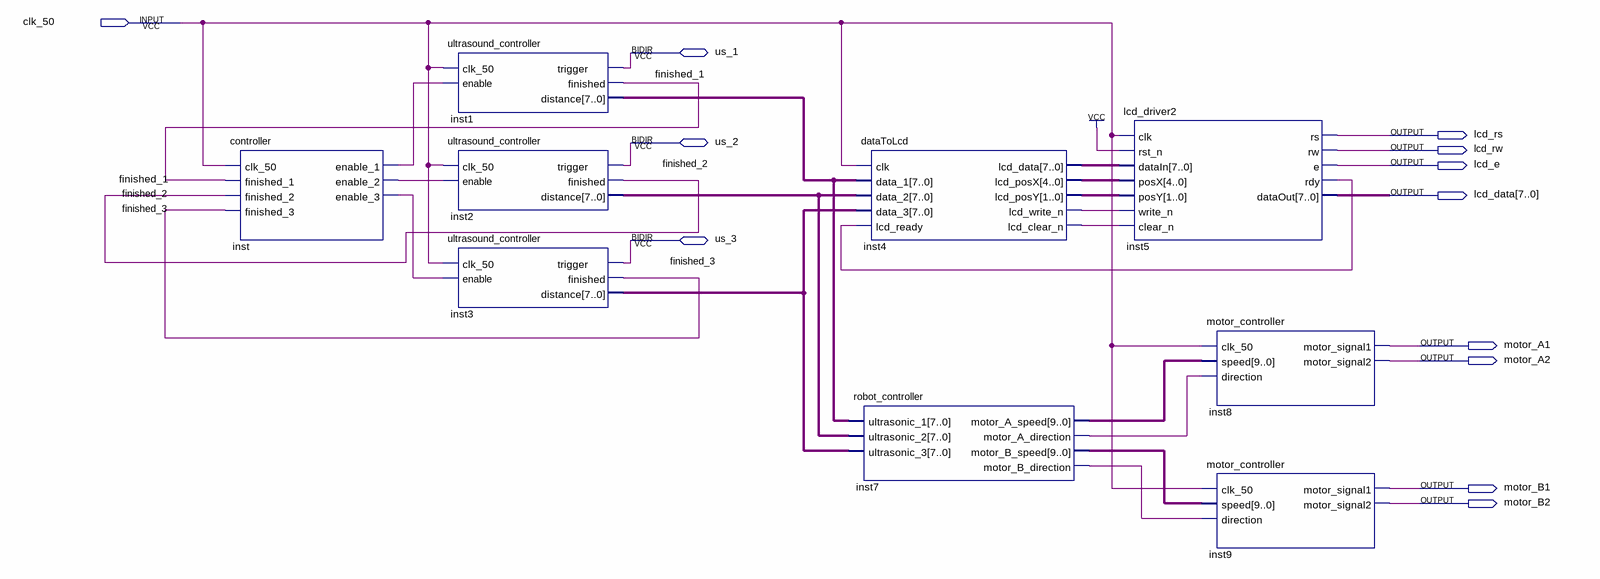
[diagram p0: schematic sheet]
// Quartus schematic ultrasound_reader.bdf as structural Verilog: 9 symbols, 12 pins
module ultrasound_reader (
  input  clk_50,
  inout  us_1,
  inout  us_2,
  inout  us_3,
  output lcd_rs,
  output lcd_rw,
  output lcd_e,
  output [7:0] lcd_data,
  output motor_A1,
  output motor_A2,
  output motor_B1,
  output motor_B2
);

  wire finished_1, finished_2, finished_3, inst4_lcd_clear_n, inst4_lcd_write_n, inst5_rdy,
       inst7_motor_a_direction, inst7_motor_b_direction, inst_enable_1, inst_enable_2, inst_enable_3;
  wire [1:0] inst4_lcd_posy;
  wire [4:0] inst4_lcd_posx;
  wire [7:0] inst1_distance, inst2_distance, inst3_distance, inst4_lcd_data;
  wire [9:0] inst7_motor_a_speed, inst7_motor_b_speed;

  controller inst (
    .clk_50(clk_50), .finished_1(finished_1), .finished_2(finished_2), .finished_3(finished_3),
    .enable_1(inst_enable_1), .enable_2(inst_enable_2), .enable_3(inst_enable_3));
  ultrasound_controller inst1 (
    .clk_50(clk_50), .enable(inst_enable_1), .finished(finished_1), .distance(inst1_distance), .trigger(us_1));
  ultrasound_controller inst2 (
    .clk_50(clk_50), .enable(inst_enable_2), .finished(finished_2), .distance(inst2_distance), .trigger(us_2));
  ultrasound_controller inst3 (
    .clk_50(clk_50), .enable(inst_enable_3), .finished(finished_3), .distance(inst3_distance), .trigger(us_3));
  robot_controller inst7 (
    .ultrasonic_1(inst1_distance), .ultrasonic_2(inst2_distance), .ultrasonic_3(inst3_distance),
    .motor_A_speed(inst7_motor_a_speed), .motor_A_direction(inst7_motor_a_direction),
    .motor_B_speed(inst7_motor_b_speed), .motor_B_direction(inst7_motor_b_direction));
  dataToLcd inst4 (
    .clk(clk_50), .data_1(inst1_distance), .data_2(inst2_distance), .data_3(inst3_distance),
    .lcd_ready(inst5_rdy), .lcd_data(inst4_lcd_data), .lcd_posX(inst4_lcd_posx), .lcd_posY(inst4_lcd_posy),
    .lcd_write_n(inst4_lcd_write_n), .lcd_clear_n(inst4_lcd_clear_n));
  lcd_driver2 inst5 (
    .clk(clk_50), .rst_n(1'b1), .dataIn(inst4_lcd_data), .posX(inst4_lcd_posx), .posY(inst4_lcd_posy),
    .write_n(inst4_lcd_write_n), .clear_n(inst4_lcd_clear_n), .rs(lcd_rs), .rw(lcd_rw), .e(lcd_e),
    .rdy(inst5_rdy), .dataOut(lcd_data));
  motor_controller inst8 (
    .clk_50(clk_50), .speed(inst7_motor_a_speed), .direction(inst7_motor_a_direction),
    .motor_signal1(motor_A1), .motor_signal2(motor_A2));
  motor_controller inst9 (
    .clk_50(clk_50), .speed(inst7_motor_b_speed), .direction(inst7_motor_b_direction),
    .motor_signal1(motor_B1), .motor_signal2(motor_B2));
endmodule
